# Altium schematic sheet LPC1768_3.SchDoc: LPC1768
size 298 x 212 mm; Date: 02.08.2016 15:40:23; SheetNumber: 4
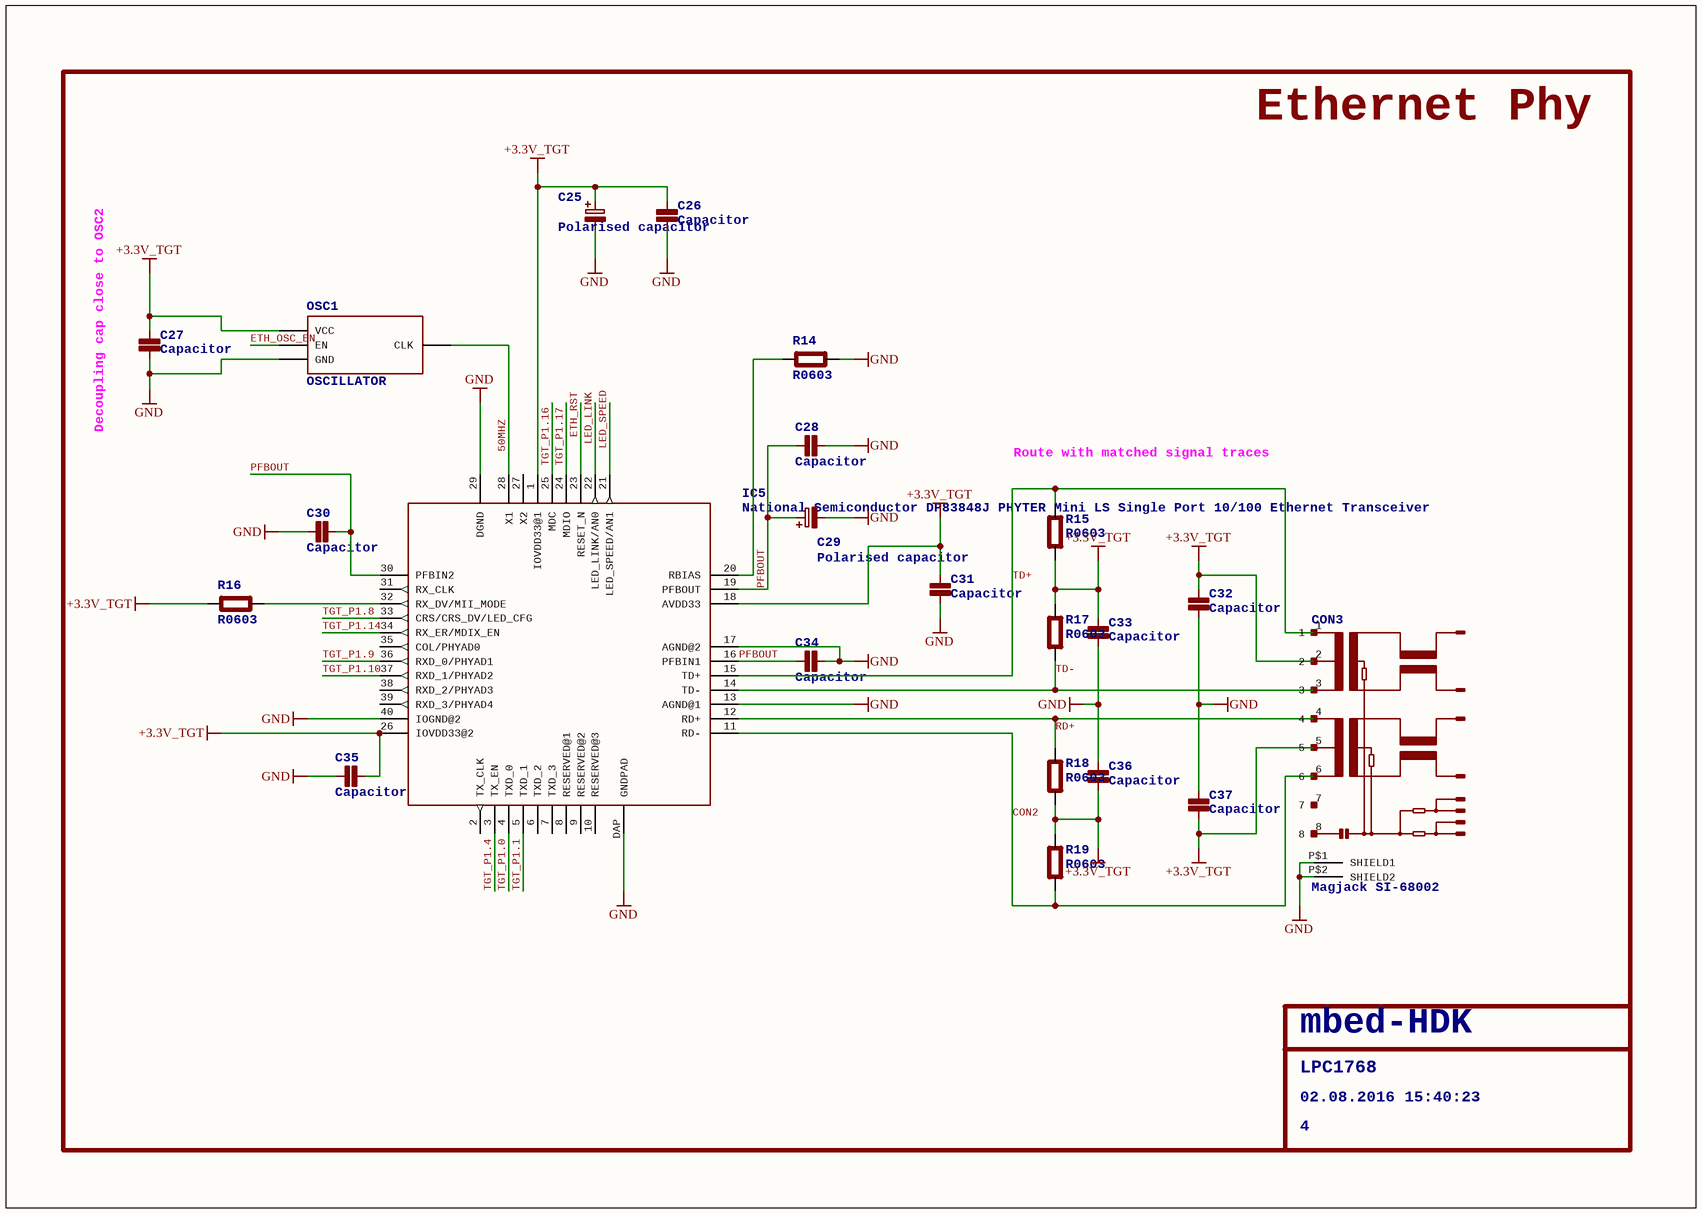
[diagram p0: LPC1768_3.SchDoc]

## Parts
C25  Polarised capacitor  [CASE-B]
C26  Capacitor  [0603]
C27  Capacitor  [0603]
C28  Capacitor  [0603]
C29  Polarised capacitor  [CASE-B]
C30  Capacitor  [0603]
C31  Capacitor  [0603]
C32  Capacitor  [0603]
C33  Capacitor  [0603]
C34  Capacitor  [0603]
C35  Capacitor  [0603]
C36  Capacitor  [0603]
C37  Capacitor  [0603]
CON3  Magjack SI-68002  [RJ45]
IC5  National Semiconductor DP83848J PHYTER Mini LS Single Port 10/100 Ethernet Transceiver  [LLP-40]
OSC1  OSCILLATOR  [3.2X.2.5]
R14  R0603  [0603]
R15  R0603  [0603]
R16  R0603  [0603]
R17  R0603  [0603]
R18  R0603  [0603]
R19  R0603  [0603]

## Nets
+3.3V_TGT: C25.1 C26.1(P$1) C27.1(P$1) C31.1(P$1) C32.1(P$1) C33.1(P$1) C35.1(P$1) C36.2(P$2) C37.2(P$2) CON3.2 CON3.5 IC5.1(IOVDD33@1) IC5.18(AVDD33) IC5.26(IOVDD33@2) OSC1.P$4(VCC) R15.1(P$1) R16.1(P$1) R17.2(P$2) R18.1(P$1) R19.2(P$2)
GND: C25.2 C26.2(P$2) C27.2(P$2) C28.1(P$1) C29.2 C30.1(P$1) C31.2(P$2) C32.2(P$2) C33.2(P$2) C34.2(P$2) C35.2(P$2) C36.1(P$1) C37.1(P$1) CON3.P$1(SHIELD1) CON3.P$2(SHIELD2) IC5.13(AGND@1) IC5.17(AGND@2) IC5.29(DGND) IC5.40(IOGND@2) IC5.DAP(GNDPAD) OSC1.P$2(GND) R14.1(P$1)
50MHZ: IC5.28(X1) OSC1.P$3(CLK)
CON2: CON3.6 IC5.11(RD-) R19.1(P$1)
ETH_OSC_EN: OSC1.P$1(EN)
ETH_RST: IC5.23(RESET_N)
LED_LINK: IC5.22(LED_LINK/AN0)
LED_SPEED: IC5.21(LED_SPEED/AN1)
PFBOUT: C28.2(P$2) C29.1 C30.2(P$2) C34.1(P$1) IC5.16(PFBIN1) IC5.19(PFBOUT) IC5.30(PFBIN2)
RD+: CON3.4 IC5.12(RD+) R18.2(P$2)
TD+: CON3.1 IC5.15(TD+) R15.2(P$2)
TD-: CON3.3 IC5.14(TD-) R17.1(P$1)
TGT_P1.0: IC5.4(TXD_0)
TGT_P1.1: IC5.5(TXD_1)
TGT_P1.4: IC5.3(TX_EN)
TGT_P1.8: IC5.33(CRS/CRS_DV/LED_CFG)
TGT_P1.9: IC5.36(RXD_0/PHYAD1)
TGT_P1.10: IC5.37(RXD_1/PHYAD2)
TGT_P1.14: IC5.34(RX_ER/MDIX_EN)
TGT_P1.16: IC5.25(MDC)
TGT_P1.17: IC5.24(MDIO)
NetIC5_20: IC5.20(RBIAS) R14.2(P$2)
NetIC5_32: IC5.32(RX_DV/MII_MODE) R16.2(P$2)

Not connected (* = marked no-connect by the designer): CON3 7 8; IC5 2(TX_CLK) 6(TXD_2) 7(TXD_3) 8(RESERVED@1) 9(RESERVED@2) 10(RESERVED@3) 27(X2) 31(RX_CLK) 35(COL/PHYAD0) 38(RXD_2/PHYAD3) 39(RXD_3/PHYAD4)

## Notes on the sheet
- Ethernet Phy
- (near C27) Decoupling cap close to OSC2
- (near R15) Route with matched signal traces
- LPC1768
- mbed-HDK
- 02.08.2016 15:40:23
- 4

## Library data of the parts
C25 C29 = C-POLB
C26-C28 C30-C37 = C0603
CON3 = RJ45
IC5 = DP83848J